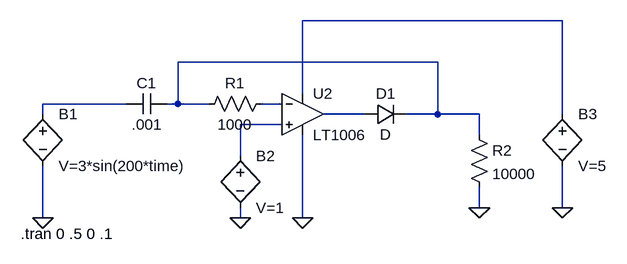
[diagram p0: schematic OpAmpPosClamp.asc]
OpAmpPosClamp.asc, the LTspice schematic file:
Version 4
SHEET 1 936 680
WIRE 816 -16 416 -16
WIRE 624 48 224 48
WIRE 416 96 416 -16
WIRE 144 112 16 112
WIRE 224 112 224 48
WIRE 224 112 208 112
WIRE 272 112 224 112
WIRE 384 112 352 112
WIRE 16 128 16 112
WIRE 512 128 448 128
WIRE 624 128 624 48
WIRE 624 128 576 128
WIRE 688 128 624 128
WIRE 816 128 816 -16
WIRE 384 144 320 144
WIRE 688 160 688 128
WIRE 320 192 320 144
WIRE 688 272 688 240
WIRE 816 272 816 208
WIRE 16 288 16 208
WIRE 320 288 320 272
WIRE 416 288 416 160
FLAG 16 288 0
FLAG 320 288 0
FLAG 688 272 0
FLAG 816 272 0
FLAG 416 288 0
SYMBOL bv 16 112 R0
SYMATTR InstName B1
SYMATTR Value V=3*sin(200*time)
SYMBOL res 368 96 R90
WINDOW 0 0 56 VBottom 2
WINDOW 3 32 56 VTop 2
SYMATTR InstName R1
SYMATTR Value 1000
SYMBOL cap 208 96 R90
WINDOW 0 0 32 VBottom 2
WINDOW 3 32 32 VTop 2
SYMATTR InstName C1
SYMATTR Value .001
SYMBOL bv 320 176 R0
SYMATTR InstName B2
SYMATTR Value V=1
SYMBOL diode 512 144 R270
WINDOW 0 32 32 VTop 2
WINDOW 3 0 32 VBottom 2
SYMATTR InstName D1
SYMBOL res 672 144 R0
SYMATTR InstName R2
SYMATTR Value 10000
SYMBOL bv 816 112 R0
SYMATTR InstName B3
SYMATTR Value V=5
SYMBOL Opamps\\LT1006 416 64 R0
SYMATTR InstName U2
TEXT -18 312 Left 2 !.tran 0 .5 0 .1

The netlist it stands for:
* OpAmpPosClamp.asc
B1 N003 0 V=3*sin(200*time)
R1 N004 N002 1000
C1 N002 N003 .001
B2 N006 0 V=1
D1 N005 N002 D
R2 N002 0 10000
B3 N001 0 V=5
XU2 N006 N004 N001 0 N005 LT1006  ; pins In+ In- V+ V- OUT
.model D D
.lib standard.dio
.tran 0 .5 0 .1
.lib LTC.lib
.backanno
.end